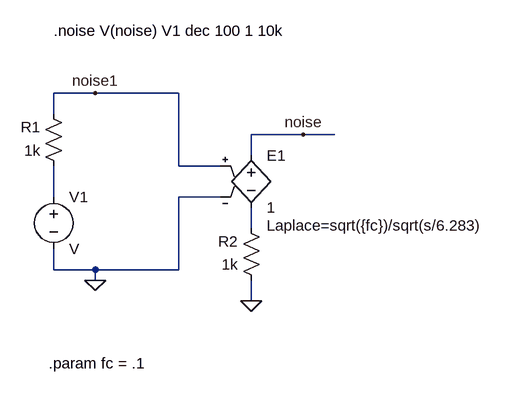
[diagram p0: schematic resistor_1_over_f_noise.asc]
resistor_1_over_f_noise.asc, the LTspice schematic file:
Version 4
SHEET 1 884 680
WIRE 208 64 144 64
WIRE 336 64 208 64
WIRE 144 96 144 64
WIRE 528 128 448 128
WIRE 576 128 528 128
WIRE 448 160 448 128
WIRE 336 176 336 64
WIRE 400 176 336 176
WIRE 144 224 144 176
WIRE 400 224 336 224
WIRE 448 272 448 240
WIRE 144 336 144 304
WIRE 208 336 144 336
WIRE 336 336 336 224
WIRE 336 336 208 336
WIRE 208 352 208 336
WIRE 448 384 448 352
FLAG 208 352 0
FLAG 208 64 noise1
FLAG 528 128 noise
FLAG 448 384 0
SYMBOL res 160 192 R180
WINDOW 0 36 76 Left 2
WINDOW 3 36 40 Left 2
SYMATTR InstName R1
SYMATTR Value 1k
SYMBOL e 448 144 R0
WINDOW 123 24 124 Left 2
SYMATTR InstName E1
SYMATTR Value 1
SYMATTR Value2 Laplace=sqrt({fc})/sqrt(s/6.283)
SYMBOL voltage 144 208 R0
SYMATTR InstName V1
SYMBOL res 464 368 R180
WINDOW 0 36 76 Left 2
WINDOW 3 36 40 Left 2
SYMATTR InstName R2
SYMATTR Value 1k
TEXT 144 -32 Left 2 !.noise V(noise) V1 dec 100 1 10k
TEXT 136 480 Left 2 !.param fc = .1

The netlist it stands for:
* resistor_1_over_f_noise.asc
R1 N001 noise1 1k
E1 noise N002 noise1 0 1 Laplace=sqrt({fc})/sqrt(s/6.283)
V1 N001 0 V
R2 0 N002 1k
.noise V(noise) V1 dec 100 1 10k
.param fc = .1
.backanno
.end